# Altium schematic sheet EEPROM_MAC.SchDoc
size A4; SheetNumber: 5
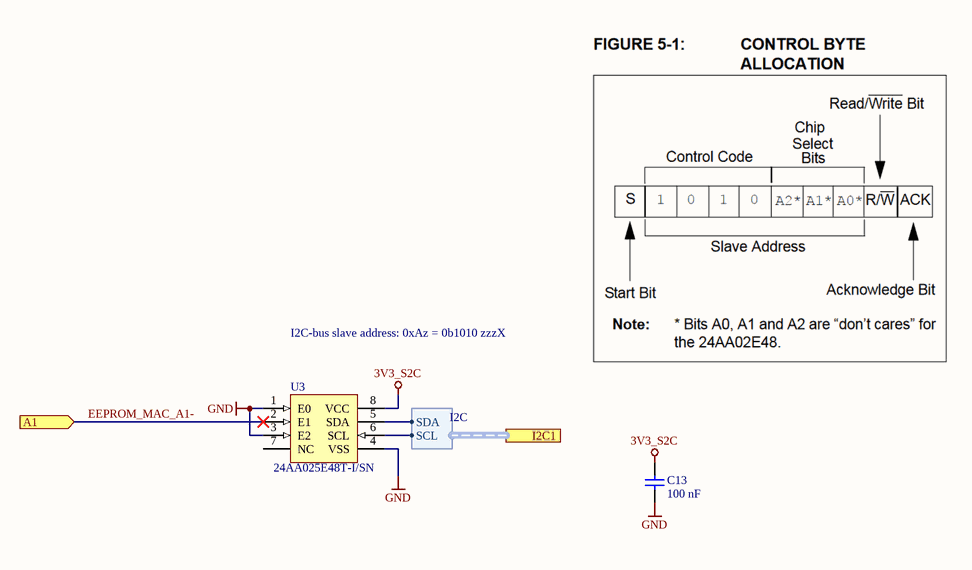
[diagram p0: EEPROM_MAC.SchDoc]

## Parts
C13  100 nF  [C_0603_TE]
U3  24AA025E48T-I/SN  [D0008A_N]

## Ports
A1 (in), I2C1 (harness I2C)

## Harnesses
I2C: SCL, SDA

## Nets
3V3_S2C: C13.1 U3.8(VCC)
GND: C13.2 U3.1(E0) U3.3(E2) U3.4(VSS)
EEPROM_MAC_A1-: U3.2(E1) ; port A1
NetU3_5: U3.5(SDA) ; port I2C1.SDA
NetU3_6: U3.6(SCL) ; port I2C1.SCL

Not connected (* = marked no-connect by the designer): U3 7(NC)

## Notes on the sheet
- I2C-bus slave address: 0xAz = 0b1010 zzzX
- Title
- Revision:
- Design Engineer:
- Date:
- Project:
- Sheet
- of

## Library data of the parts
C13 = UZgen_C_0603_100nF_50V_X7R: Generic capacitor; Manufacturer: UZgen; Tolerance: 10 %; Voltage: 50V; Created from: AGeiger; Technology: X7R; Value: 100 nF; Manufacturer Part Number: UZgen_C_0603_100nF_50V_X7R; PartID: 1; Created On: 02/07/2024 14:42:23; Device Package: 0603; Mounting Type: SMD; Last Updated: 08/08/2024 15:01:15
U3 = 24AA025E48T-I/SN: 2Kbit I2C SOP-8 EEPROM ROHS; Manufacturer: Microchip Tech; Created from: FRosner; ComponentLink1Description: Datasheet; ComponentLink1URL: https://wmsc.lcsc.com/wmsc/upload/file/pdf/v2/lcsc/2202010930_Microchip-Tech-24AA025E48T-I-SN_C2060925.pdf; Manufacturer Part Number: 24AA025E48T-I/SN; PartID: 7; Created On: 07/09/2024 12:18:21; Component Type: EEPROM; Device Package: SOIC-8; Last Updated: 10/09/2024 09:33:15; Mounting Type: SMD; Operating Temperature: -40 to +85 °C; Series: 24AA025; Supplier 1: Mouser; Supplier Part Number 1: 579-24AA025E48T-I/SN; Supplier 2: LCSC; Supplier Part Number 2: C2060925; Type: Memory; Value: 24AA025E48T-I/SN; LCSC Part Number: C2060925